# Altium schematic sheet Sensor-Flash.SchDoc: Sensor & Flash
size A4; SheetNumber: 3; SheetTotal: 3; SheetSize: A4
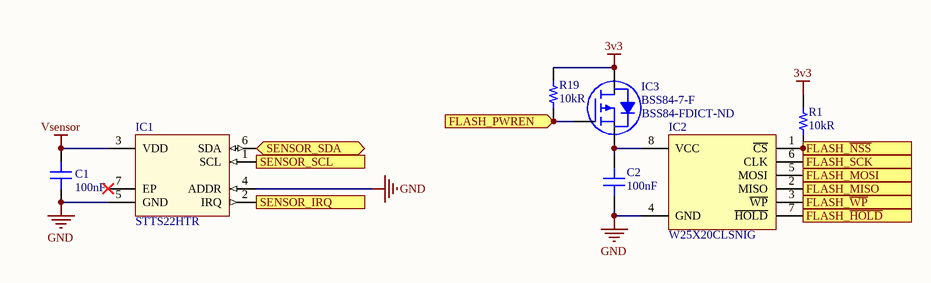
[diagram p0: Sensor-Flash.SchDoc]

## Parts
C1  100nF  [CAP 0603/1608]
C2  100nF  [CAP 0603/1608]
IC1  STTS22HTR  [ST UDFN-6 2x2x0.5]
IC2  W25X20CLSNIG  [WINBOND SOIC-8 208MIL WIDE]
IC3  BSS84-7-F  Supplier Part Number 1: BSS84-FDICT-ND  [DIODES SOT-23-3]
R1  10kR  [RES 0603/1608]
R19  10kR  [RES 0603/1608]

## Ports
FLASH_MISO (out), FLASH_MOSI (in), FLASH_PWREN (in), FLASH_SCK (in), FLASH_~{HOLD} (in), FLASH_~{NSS} (in), FLASH_~{WP} (in), SENSOR_IRQ (out), SENSOR_SCL (in), SENSOR_SDA (bidir)

## Nets
3v3: IC3.3(D) R1.2 R19.2
GND: C1.1 C2.2 IC1.4(ADDR) IC1.5(GND) IC2.4(GND)
Vsensor: C1.2 IC1.3(VDD)
FLASH_~{HOLD}: IC2.7(~{HOLD}) ; port FLASH_~{HOLD}
FLASH_MISO: IC2.2(MISO) ; port FLASH_MISO
FLASH_MOSI: IC2.5(MOSI) ; port FLASH_MOSI
FLASH_~{NSS}: IC2.1(~{CS}) R1.1 ; port FLASH_~{NSS}
FLASH_PWREN: IC3.1(G) R19.1 ; port FLASH_PWREN
FLASH_SCK: IC2.6(CLK) ; port FLASH_SCK
FLASH_~{WP}: IC2.3(~{WP}) ; port FLASH_~{WP}
SENSOR_IRQ: IC1.2(IRQ) ; port SENSOR_IRQ
SENSOR_SCL: IC1.1(SCL) ; port SENSOR_SCL
SENSOR_SDA: IC1.6(SDA) ; port SENSOR_SDA
NetC2_1: C2.1 IC2.8(VCC) IC3.2(S)

Not connected (* = marked no-connect by the designer): IC1 7(EP)*

## Notes on the sheet
- Title:
- Size:
- Project:
- Revision:
- Sheet
- of
- Date:
- YıLDıZ IoT
- Elperek Mahallesi
- Saray Sokak, No:12
- SAKARYA / TURKEY
- File:

## Library data of the parts
C1 C2 = Capacitor - Ceramic: Ceramic, SMT Capacitor; Manufacturer: Samsung; Manufacturer Part Number: CL10B104JB8NNNC; Tolerance: 5%; Voltage Rating: 50V; Dielectric: X7R; Supplier 1: Digi-Key; Supplier Part Number 1: 1276-1033-1-ND; RoHS: Yes; Mount: Surface Mount; Case/Package: 0603; Case Code (Metric): 1608; Case Code (Imperial): 0603; Material: Ceramic; Contact Plating: Tin; Min Operating Temperature: -55°C; Max Operating Temperature: 125°C; Packaging: Tape and Reel; Package Quantity: 1; Capacitance: 100nF; Voltage: 50V; Length: 1.6mm; Height: 0.8mm; Width: 0.031inch; Thickness: 0.035inch; Depth: 0.8mm; Radiation Hardening: No
  C1: Stock 1: 223594; Pricing 1: 1 = 0,10000, 10 = 0,05300, 100 = 0,02350, 500 = 0,01680, 1000 = 0,01320 (USD); ComponentLink1URL: https://media.digikey.com/pdf/Data%20Sheets/Samsung%20PDFs/CL_Series_MLCC_ds.pdf?src-supplier=Digi-Key; ComponentLink1Description: https://media.digikey.com/pdf/Data%20Sheets/Samsung%20PDFs/CL_Series_MLCC_ds.pdf?src-supplier=Digi-Key; ComponentLink2URL: https://www.verical.com/server-webapp/html/getDatasheet?partID=359321&src-supplier=Verical; ComponentLink2Description: https://www.verical.com/server-webapp/html/getDatasheet?partID=359321&src-supplier=Verical; ComponentLink3URL: http://www1.futureelectronics.com/doc/SAMSUNG/CL10B104JB8NNNC.pdf?src-supplier=Future+Electronics; ComponentLink3Description: http://www1.futureelectronics.com/doc/SAMSUNG/CL10B104JB8NNNC.pdf?src-supplier=Future+Electronics; ComponentLink4URL: https://produktinfo.conrad.com/datenblaetter/450000-474999/456613-da-01-en-VS_KONDENSATOR_0603.pdf?src-supplier=Conrad; ComponentLink4Description: https://produktinfo.conrad.com/datenblaetter/450000-474999/456613-da-01-en-VS_KONDENSATOR_0603.pdf?src-supplier=Conrad
  C2: Stock 1: 305374; Pricing 1: 1 = 0,10000, 10 = 0,04800, 100 = 0,02160, 500 = 0,01540, 1000 = 0,01210 (USD); ComponentLink1URL: https://datasheet.ciiva.com/25793/cl10b104jb8nnnc-25793394.pdf?src-supplier=Digi-Key; ComponentLink1Description: https://datasheet.ciiva.com/25793/cl10b104jb8nnnc-25793394.pdf?src-supplier=Digi-Key; ComponentLink2URL: https://datasheet.ciiva.com/26838/getdatasheetpartid-359321-26838402.pdf?src-supplier=Verical; ComponentLink2Description: https://datasheet.ciiva.com/26838/getdatasheetpartid-359321-26838402.pdf?src-supplier=Verical; ComponentLink3URL: https://datasheet.ciiva.com/16498/cl10b104jb8nnnc-16498485.pdf?src-supplier=Future+Electronics; ComponentLink3Description: https://datasheet.ciiva.com/16498/cl10b104jb8nnnc-16498485.pdf?src-supplier=Future+Electronics; ComponentLink4URL: https://datasheet.ciiva.com/29199/456613-da-01-en-vs-kondensator-0603-29199008.pdf?src-supplier=Conrad; ComponentLink4Description: https://datasheet.ciiva.com/29199/456613-da-01-en-vs-kondensator-0603-29199008.pdf?src-supplier=Conrad
IC1 = ST STTS22HTR: Low-voltage, ultra-low-power, 0.5 °C accuracy I²C/SMBus 3.0 temperature sensor; Manufacturer_Name: STMicroelectronics; Datasheet Link: https://www.mouser.com/datasheet/2/389/stts22h-1663205.pdf; Height: 0.55mm; Manufacturer_Part_Number: STTS22HTR; Mouser Part Number: 511-STTS22HTR; Mouser Price/Stock: https://www.mouser.co.uk/ProductDetail/STMicroelectronics/STTS22HTR?qs=%252B6g0mu59x7LCfjXXPvLkpg%3D%3D; RS Part Number: 1947647P; RS Price/Stock: http://uk.rs-online.com/web/p/products/1947647P; Supplier 1: Digi-Key; Supplier Part Number 1: 497-STTS22HCT-ND; Manufacturer: STMicroelectronics; Manufacturer Part Number: STTS22HTR; Stock 1: 5772; Pricing 1: 1 = 1,53000, 10 = 1,37200, 25 = 1,30200, 100 = 1,06950, 250 = 0,99976, 500 = 0,88350, 1000 = 0,69750 (USD); RoHS: No
IC2 = WINBOND FLASH SPI 8PIN: Address Bus Width: 24b; Density: 2Mb; Interface: SPI,Serial; Number of Words: 256000; Max Supply Voltage: 3.6V; Min Supply Voltage: 2.3V; Nominal Supply Current: 14mA; Access Time: 8ns; Memory Type: FLASH; Frequency: 50MHz; Sync/Async: Synchronous; ComponentLink1URL: http://www.winbond.com/resource-files/w25q128jv_dtr%20revc%2003272018%20plus.pdf?src-supplier=Digi-Key; ComponentLink1Description: http://www.winbond.com/resource-files/w25q128jv_dtr%20revc%2003272018%20plus.pdf?src-supplier=Digi-Key; Supplier 1: Digi-Key; Supplier Part Number 1: W25X20CLSNIG-ND; Manufacturer: Winbond; Manufacturer Part Number: W25X20CLSNIG; Stock 1: 12189; Pricing 1: 1 = 0,35000, 10 = 0,34200, 25 = 0,31800, 50 = 0,31600, 100 = 0,28080, 250 = 0,27712, 500 = 0,27298, 1000 = 0,26566, 5000 = 0,23877 (USD); RoHS: Yes; Mount: Surface Mount; Case/Package: SOIC; Number of Pins: 8; Min Operating Temperature: -40°C; Max Operating Temperature: 85°C; Package Quantity: 100; Packaging: Rail/Tube; Radiation Hardening: No; ComponentLink2URL: https://datasheet.ciiva.com/1907/serialflashselectionguide1112911-1907412.pdf?src-supplier=Digi-Key; ComponentLink2Description: https://datasheet.ciiva.com/1907/serialflashselectionguide1112911-1907412.pdf?src-supplier=Digi-Key
IC3 = BSS84-7-F: MOSFET P-CH 50V 130MA SOT23-3; Manufacturer: Diodes; Description: DIODES INC. - BSS84-7-F - MOSFET Transistor, P Channel, 130 mA, -50 V, 10 ohm, -5 V, -800 mV; Input Capacitance: 45pF; Number of Elements: 1; Max Power Dissipation: 300mW; Rds On Max: 10R; Voltage Rating (DC): -50V; Current Rating: -130mA; Element Configuration: Single; Gate to Source Voltage (Vgs): 20V; Turn-Off Delay Time: 18ns; Turn-On Delay Time: 10ns; Threshold Voltage: -800mV; ComponentLink1Description: Datasheet; ComponentLink1URL: https://www.diodes.com/assets/Datasheets/ds30149.pdf; ComponentLink2Description: DigiKey Link; ComponentLink2URL: http://digikey.com/product-detail/en/diodes-incorporated/BSS84-7-F/BSS84-FDICT-ND/717844; Supplier 1: Digi-Key; Manufacturer Part Number: BSS84-7-F; Stock 1: 1235678; Pricing 1: 1 = 0,23000, 10 = 0,19000, 25 = 0,15920, 100 = 0,07780, 250 = 0,07656, 500 = 0,06488, 1000 = 0,04508 (USD); RoHS: Yes; Mount: Surface Mount; Case/Package: SOT-23; Number of Pins: 3; Weight: 0.000282oz; Contact Plating: Tin,Matte; Min Operating Temperature: -55°C; Max Operating Temperature: 150°C; Packaging: Tape and Reel; Package Quantity: 3000; Number of Channels: 1; On-State Resistance: 10R; Power Dissipation: 300mW; Drain to Source Resistance: 10R; Drain to Source Voltage (Vdss): -50V; Continuous Drain Current (ID): 130mA; Length: 2.9mm; Height: 1mm; Width: 1.3mm; Lead Free: Lead Free; REACH SVHC: No SVHC; ComponentLink3URL: https://datasheet.ciiva.com/16221/ds30149-16221984.pdf?src-supplier=Future+Electronics; ComponentLink3Description: https://datasheet.ciiva.com/16221/ds30149-16221984.pdf?src-supplier=Future+Electronics; ComponentLink4URL: https://datasheet.ciiva.com/4442/ds30149-42275-4442950.pdf?src-supplier=Mouser; ComponentLink4Description: https://datasheet.ciiva.com/4442/ds30149-42275-4442950.pdf?src-supplier=Mouser; ComponentLink5URL: https://datasheet.ciiva.com/934/ds30149-934539.pdf?src-supplier=Digi-Key; ComponentLink5Description: https://datasheet.ciiva.com/934/ds30149-934539.pdf?src-supplier=Digi-Key; ComponentLink6URL: https://datasheet.ciiva.com/8115/ds30149-8115403.pdf?src-supplier=Avnet; ComponentLink6Description: https://datasheet.ciiva.com/8115/ds30149-8115403.pdf?src-supplier=Avnet; ComponentLink7URL: https://datasheet.ciiva.com/934/ds30149-934540.pdf?src-supplier=Digi-Key; ComponentLink7Description: https://datasheet.ciiva.com/934/ds30149-934540.pdf?src-supplier=Digi-Key; ComponentLink8URL: https://datasheet.ciiva.com/49020/70437757-49020999.pdf?src-supplier=Allied+Electronics; ComponentLink8Description: https://datasheet.ciiva.com/49020/70437757-49020999.pdf?src-supplier=Allied+Electronics
R1 R19 = Resistor_Chip: Ceramic, SMT Capacitor; Manufacturer: Stackpole Electronics; Manufacturer Part Number: RNCP0603FTD10K0; Tolerance: 1%; Max Power Dissipation: 125mW; Temperature Coefficient: 100ppm/°C; Supplier 1: Digi-Key; Supplier Part Number 1: RNCP0603FTD10K0CT-ND; Stock 1: 619664; Pricing 1: 1 = 0,10000, 10 = 0,06700, 100 = 0,02730, 1000 = 0,01224, 2500 = 0,01063 (USD); RoHS: Yes; Mount: Surface Mount; Case/Package: 0603; Case Code (Metric): 1608; Case Code (Imperial): 0603; Contact Plating: Tin,Matte; Min Operating Temperature: -55°C; Max Operating Temperature: 155°C; Packaging: Tape and Reel; Resistance: 10kR; Composition: Thin Film; Number of Terminations: 2; Features: Moisture Resistant,Anti-Sulfur; Length: 0.059inch; Height: 0.02inch; Width: 0.031inch; Radiation Hardening: No; Lead Free: Lead Free; ComponentLink1URL: https://www.seielect.com/Catalog/SEI-rncp.pdf?src-supplier=Avnet; ComponentLink1Description: https://www.seielect.com/Catalog/SEI-rncp.pdf?src-supplier=Avnet; ComponentLink2URL: https://www.seielect.com/catalog/SEI-Packaging.pdf?src-supplier=Digi-Key; ComponentLink2Description: https://www.seielect.com/catalog/SEI-Packaging.pdf?src-supplier=Digi-Key; ComponentLink3URL: https://www.seielect.com/Catalog/SEI-rncp.pdf?src-supplier=Digi-Key; ComponentLink3Description: https://www.seielect.com/Catalog/SEI-rncp.pdf?src-supplier=Digi-Key